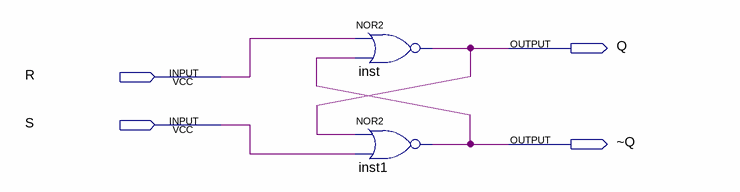
[diagram p0: schematic sheet]
// Quartus schematic lab9step1.bdf as structural Verilog: 2 symbols, 4 pins
module lab9step1 (
  input  R,
  input  S,
  output Q,
  output \~Q 
);

  nor inst (Q, R, \~Q );
  nor inst1 (\~Q , Q, S);
endmodule
